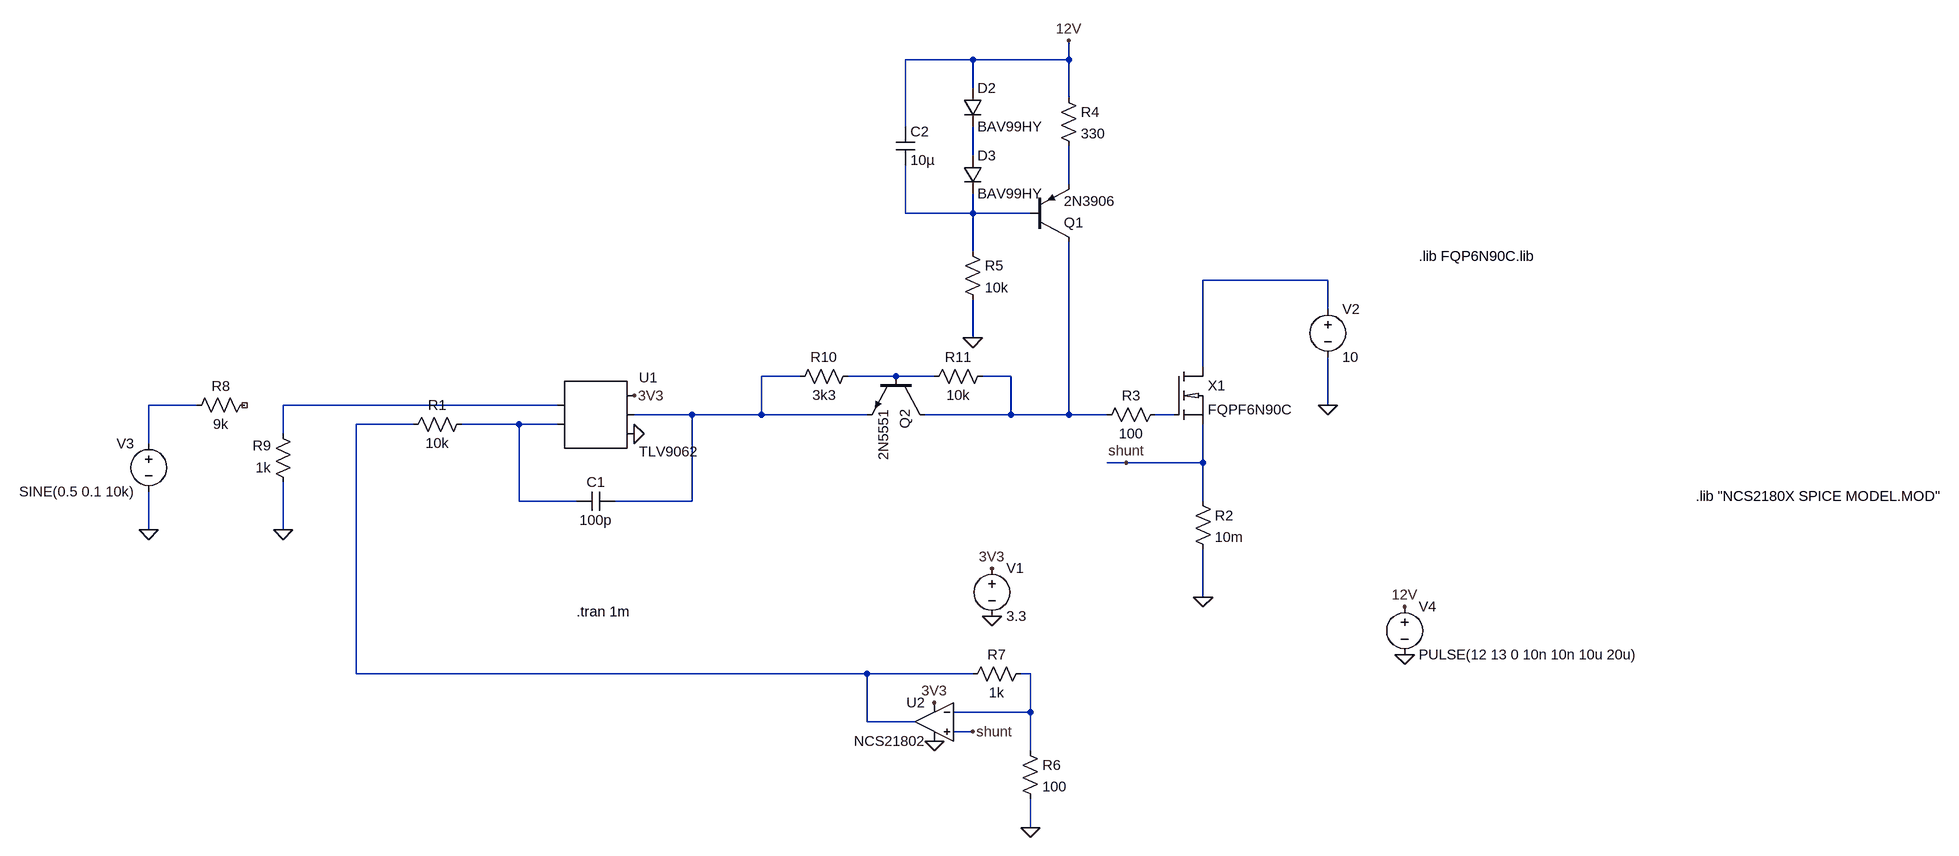
[diagram p0: schematic 3.3vzener_gate_drive_amp.asc]
3.3vzener_gate_drive_amp.asc, the LTspice schematic file:
Version 4
SHEET 1 3992 916
WIRE 448 -416 336 -416
WIRE 608 -416 608 -448
WIRE 608 -416 448 -416
WIRE 448 -368 448 -416
WIRE 608 -352 608 -416
WIRE 336 -304 336 -416
WIRE 448 -256 448 -304
WIRE 608 -208 608 -272
WIRE 336 -160 336 -240
WIRE 448 -160 448 -192
WIRE 448 -160 336 -160
WIRE 544 -160 448 -160
WIRE 448 -96 448 -160
WIRE 1040 -48 832 -48
WIRE 1040 0 1040 -48
WIRE 448 48 448 -16
WIRE 832 96 832 -48
WIRE 160 112 96 112
WIRE 320 112 240 112
WIRE 384 112 320 112
WIRE 512 112 464 112
WIRE -944 160 -1024 160
WIRE -336 160 -800 160
WIRE 1040 160 1040 80
WIRE -112 176 -208 176
WIRE 96 176 96 112
WIRE 96 176 -112 176
WIRE 272 176 96 176
WIRE 512 176 512 112
WIRE 512 176 368 176
WIRE 608 176 608 -112
WIRE 608 176 512 176
WIRE 672 176 608 176
WIRE 784 176 752 176
WIRE -576 192 -672 192
WIRE -400 192 -496 192
WIRE -336 192 -400 192
WIRE -800 208 -800 160
WIRE -1024 224 -1024 160
WIRE 704 256 672 256
WIRE 832 256 832 192
WIRE 832 256 704 256
WIRE -400 320 -400 192
WIRE -304 320 -400 320
WIRE -112 320 -112 176
WIRE -112 320 -240 320
WIRE 832 320 832 256
WIRE -1024 368 -1024 304
WIRE -800 368 -800 288
WIRE 832 480 832 400
WIRE -672 608 -672 192
WIRE 272 608 -672 608
WIRE 448 608 272 608
WIRE 544 608 528 608
WIRE 544 672 544 608
WIRE 544 672 416 672
WIRE 272 688 272 608
WIRE 352 688 272 688
WIRE 448 704 416 704
WIRE 544 736 544 672
WIRE 544 864 544 816
FLAG -208 208 0
FLAG -208 144 3V3
FLAG 480 432 3V3
FLAG 480 512 0
FLAG 832 480 0
FLAG 1040 160 0
FLAG 704 256 shunt
FLAG -1024 368 0
FLAG 1168 496 12V
FLAG 1168 576 0
FLAG 608 -448 12V
FLAG 448 704 shunt
FLAG 544 864 0
FLAG 384 720 0
FLAG 384 656 3V3
FLAG 448 48 0
FLAG -800 368 0
SYMBOL AutoGenerated\\TLV9062 -272 176 R0
SYMATTR InstName U1
SYMBOL voltage 480 416 R0
WINDOW 123 0 0 Left 0
WINDOW 39 0 0 Left 0
SYMATTR InstName V1
SYMATTR Value 3.3
SYMBOL res -480 176 R90
WINDOW 0 0 56 VBottom 2
WINDOW 3 32 56 VTop 2
SYMATTR InstName R1
SYMATTR Value 10k
SYMBOL cap -240 304 R90
WINDOW 0 0 32 VBottom 2
WINDOW 3 32 32 VTop 2
SYMATTR InstName C1
SYMATTR Value 100p
SYMBOL res 816 304 R0
SYMATTR InstName R2
SYMATTR Value 10m
SYMBOL voltage 1040 -16 R0
WINDOW 123 0 0 Left 0
WINDOW 39 0 0 Left 0
SYMATTR InstName V2
SYMATTR Value 10
SYMBOL voltage -1024 208 M0
WINDOW 123 0 0 Left 0
WINDOW 39 0 0 Left 0
SYMATTR InstName V3
SYMATTR Value SINE(0.5 0.1 10k)
SYMBOL n_channel_mosfet 784 96 R0
SYMATTR InstName X1
SYMBOL res 768 160 R90
WINDOW 0 0 56 VBottom 2
WINDOW 3 32 56 VTop 2
SYMATTR InstName R3
SYMATTR Value 100
SYMBOL voltage 1168 480 R0
WINDOW 123 0 0 Left 0
WINDOW 39 0 0 Left 0
SYMATTR InstName V4
SYMATTR Value PULSE(12 13 0 10n 10n 10u 20u)
SYMBOL OpAmps\\opamp2 384 624 M0
SYMATTR InstName U2
SYMATTR Value NCS21802
SYMBOL res 528 720 R0
SYMATTR InstName R6
SYMATTR Value 100
SYMBOL res 544 592 R90
WINDOW 0 0 56 VBottom 2
WINDOW 3 32 56 VTop 2
SYMATTR InstName R7
SYMATTR Value 1k
SYMBOL pnp 544 -112 M180
SYMATTR InstName Q1
SYMATTR Value 2N3906
SYMBOL res 592 -368 R0
SYMATTR InstName R4
SYMATTR Value 330
SYMBOL diode 432 -368 R0
SYMATTR InstName D2
SYMATTR Value BAV99HY
SYMBOL cap 320 -304 R0
SYMATTR InstName C2
SYMATTR Value 10µ
SYMBOL res 432 -112 R0
SYMATTR InstName R5
SYMATTR Value 10k
SYMBOL res -848 144 R90
WINDOW 0 0 56 VBottom 2
WINDOW 3 32 56 VTop 2
SYMATTR InstName R8
SYMATTR Value 9k
SYMBOL res -784 304 R180
WINDOW 0 36 76 Left 2
WINDOW 3 36 40 Left 2
SYMATTR InstName R9
SYMATTR Value 1k
SYMBOL diode 432 -256 R0
SYMATTR InstName D3
SYMATTR Value BAV99HY
SYMBOL npn 368 112 R90
SYMATTR InstName Q2
SYMATTR Value 2N5551
SYMBOL res 256 96 R90
WINDOW 0 0 56 VBottom 2
WINDOW 3 32 56 VTop 2
SYMATTR InstName R10
SYMATTR Value 3k3
SYMBOL res 480 96 R90
WINDOW 0 0 56 VBottom 2
WINDOW 3 32 56 VTop 2
SYMATTR InstName R11
SYMATTR Value 10k
TEXT -304 504 Left 2 !.tran 1m
TEXT 1192 -88 Left 2 !.lib FQP6N90C.lib
TEXT 1768 312 Left 2 !.lib "NCS2180X SPICE MODEL.MOD"

The netlist it stands for:
* 3.3vzener_gate_drive_amp.asc
* U1: TLV9062 (symbol AutoGenerated\TLV9062 not available, pins judged from their places): pin1=N009 pin2=N012 pin3=3V3 pin4=N005 pin5=0
V1 3V3 0 3.3
R1 N012 N011 10k
C1 N005 N012 100p
R2 shunt 0 10m
V2 N004 0 10
V3 N008 0 SINE(0.5 0.1 10k)
XX1 N004 N010 shunt FQPF6N90C  ; pins D G S
R3 N010 N007 100
V4 12V 0 PULSE(12 13 0 10n 10n 10u 20u)
XU2 shunt N013 3V3 0 N011 NCS21802  ; pins In+ In- V+ V- OUT
R6 N013 0 100
R7 N013 N011 1k
Q1 N007 N003 N002 0 2N3906
R4 12V N002 330
D2 12V N001 BAV99HY
C2 12V N003 10µ
R5 N003 0 10k
R8 NC_01 N008 9k
R9 0 N009 1k
D3 N001 N003 BAV99HY
Q2 N007 N006 N005 0 2N5551
R10 N006 N005 3k3
R11 N007 N006 10k
.model D D
.lib standard.dio
.model NPN NPN
.model PNP PNP
.lib standard.bjt
.tran 1m
.lib FQP6N90C.lib
.lib "NCS2180X SPICE MODEL.MOD"
.lib FQP6N90C.lib
.backanno
.end